# EAGLE design Qwiic Pi SHIM (EAGLE 9.5.1)
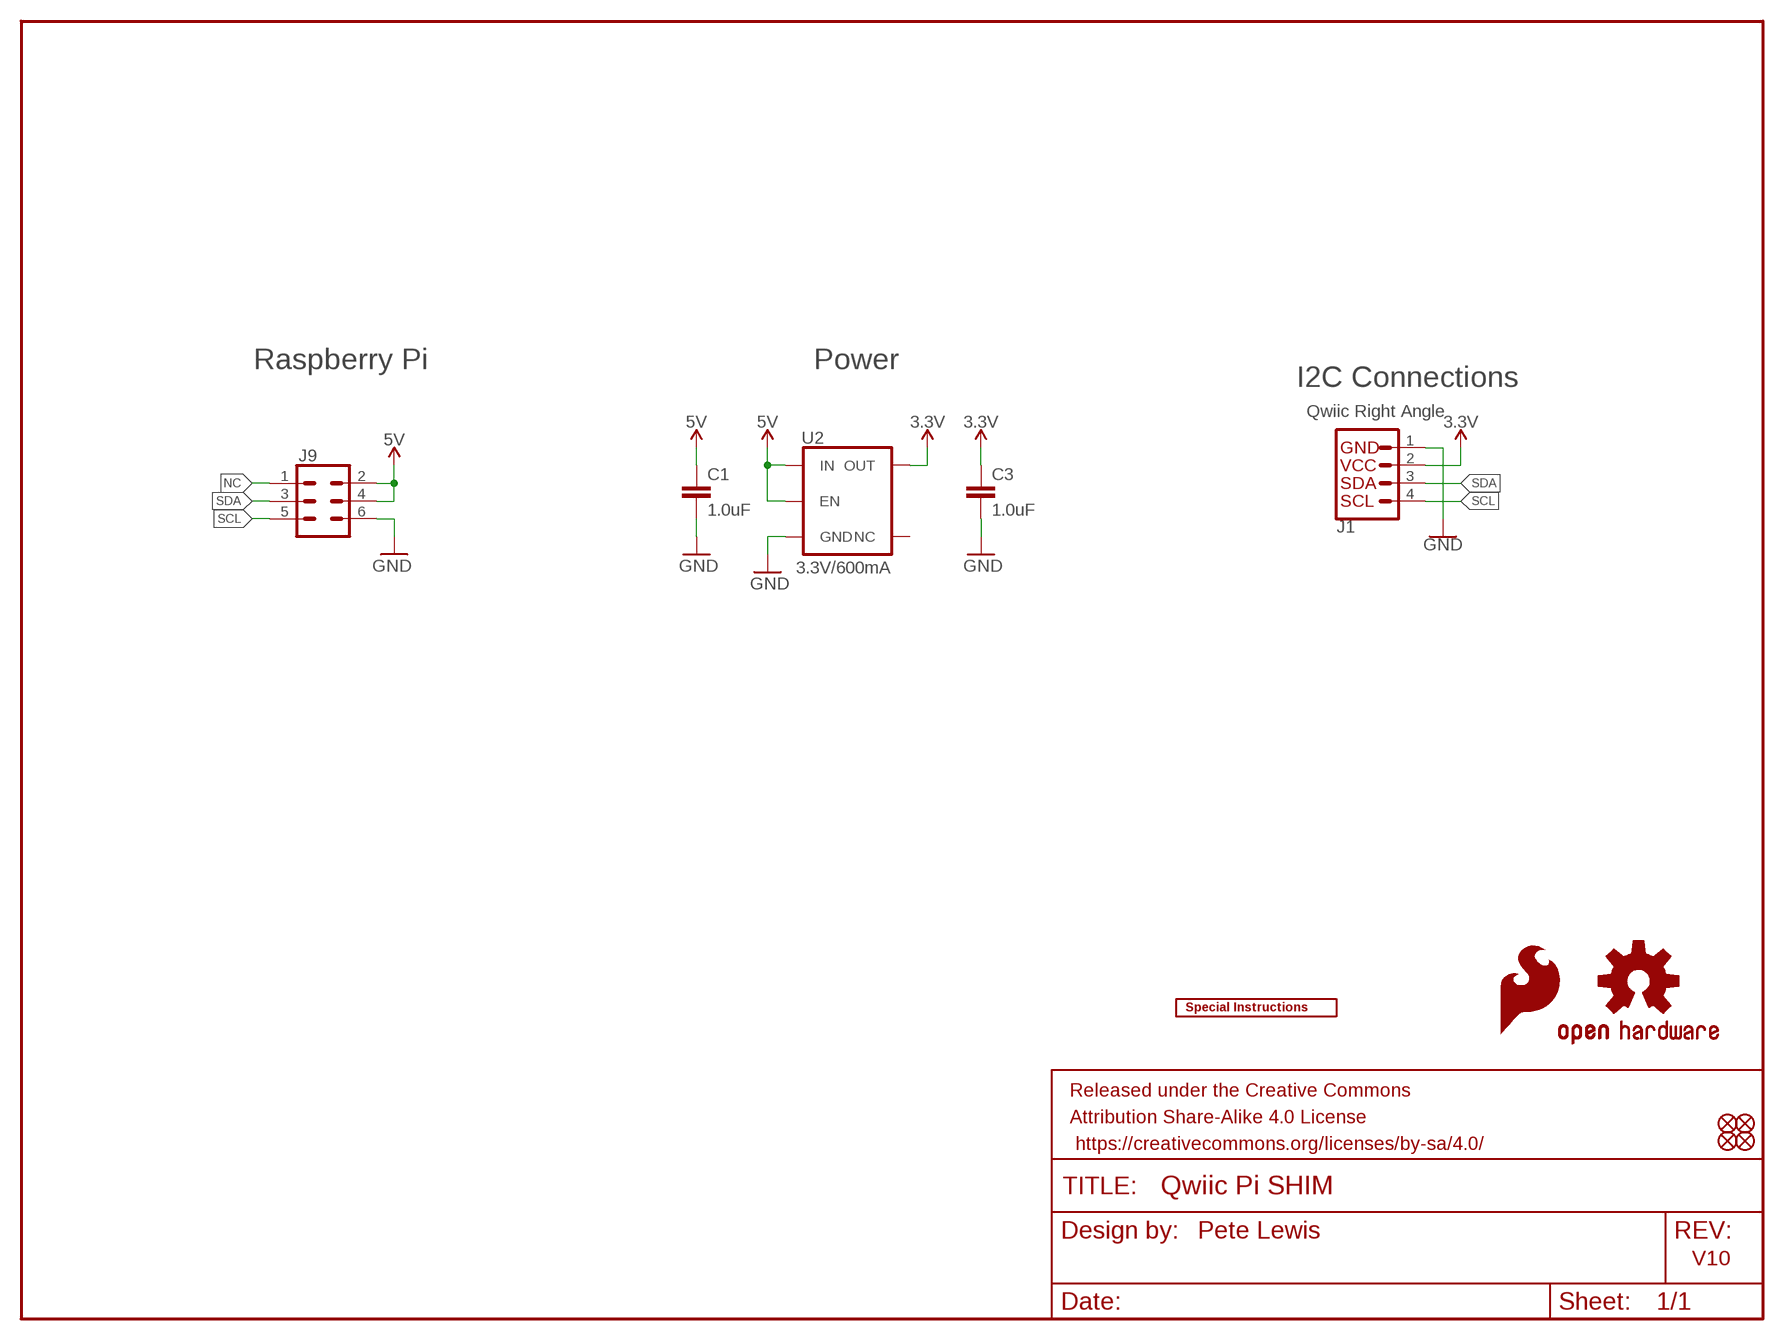
[diagram p0: schematic, sheet 1]

## Parts
C1  1.0uF  1.0UF-0603-16V-10%  [0603]
C3  1.0uF  1.0UF-0603-16V-10%  [0603]
FD1  FIDUCIALUFIDUCIAL  [FIDUCIAL-MICRO]
FD2  FIDUCIALUFIDUCIAL  [FIDUCIAL-MICRO]
FD3  FIDUCIALUFIDUCIAL  [FIDUCIAL-MICRO]
FD4  FIDUCIALUFIDUCIAL  [FIDUCIAL-MICRO]
FRAME1  FRAME-LETTER  [CREATIVE_COMMONS]
J1  Qwiic Right Angle  I2C_STANDARDQWIIC  [1X04_1MM_RA]
J9  SPARKFUN-CONNECTORS_CONN_03X2SINGLE_SLOT-4MILS  [SPARKFUN-CONNECTORS_2X3-NS_PISHIM_LOCKING_SLOTS-4MILS]
LOGO1  OSHW-LOGOMINI  [OSHW-LOGO-MINI]
U2  3.3V/600mA  V_REG_AP2112K-3.3V  [SOT23-5]
U$1  SFE_LOGO_FLAME.1_INCH  [SFE_LOGO_FLAME_.1]
U$4  SPECIAL_INSTRUCTIONS-ORDERING  [ORDERING_INSTRUCTIONS]

## Nets
3.3V: C3.1 J1.2 U2.5(OUT)
5V: C1.1 J9.2 J9.4 U2.1(IN) U2.3(EN)
GND [vcc]: C1.2 C3.2 J1.1 J9.6 U2.2(GND)
NC: J9.1
SCL: J1.4 J9.5
SDA: J1.3 J9.3
Unconnected: U2.4(NC)

## Notes on the sheet
- Raspberry Pi | Power
- I2C Connections
- Pete Lewis
- V10

## Library data of the parts
C1 C3 = SparkFun-Capacitors:1.0UF: 1µF ceramic capacitors A capacitor is a passive two-terminal electrical component used to store electrical energy temporarily in an electric field.; PROD_ID: CAP-00868
FD1-FD4 = SparkFun-Aesthetics:FIDUCIAL: Fiducial Alignment Points Point-of-reference for pick-and-place machines and other optical instruments.
FRAME1 = SparkFun-Aesthetics:FRAME-LETTER: Schematic Frame Standard 8.5x11 US Letter frame
J1 = SparkFun-Connectors:I2C_STANDARD: SparkFun I2C Standard Pinout Header SparkFun has standardized on a pinout for all I2C based sensor breakouts. This pinout allows I2C boards to be plugged directly into the headers on Arduino Uno compatible boards, and to be daisy chained easily. Example SparkFun Products: SparkFun Atmospheric Sensor Breakout - BME280 <https://www.sparkfun.com/products/13676> SparkFun Altitude/Pressure Sensor Breakout - MPL3115A2 <https://www.sparkfun.com/products/11084> SparkFun TOF Range Finder Sensor - VL6180 <https://www.sparkfun.com/products/12785>; PROD_ID: CONN-13694
J9 = Qwiic Pi SHIM:SPARKFUN-CONNECTORS_CONN_03X2: Multi connection point. Often used as Generic Header-pin footprint for 0.1 inch spaced/style header connections You can populate with any combo of single row headers, but if you'd like an exact match, check these: Header - 2x3 (Male, 0.1") <https://www.sparkfun.com/products/12807> (PRT-12807) Header - 2x3 (Female, 0.1") <https://www.sparkfun.com/products/13010> (PRT-13010) 2x3 Pin Shrouded Header <https://www.sparkfun.com/products/10877> (PRT-10877) On any of the 0.1 inch spaced packages, you can populate with these: Break Away Headers - Straight <https://www.sparkfun.com/products/116> (PRT-00116) Break Away Male Headers - Right Angle <https://www.sparkfun.com/products/553> (PRT-00553) Female Headers <https://www.sparkfun.com/products/115> (PRT-00115) Break Away Headers - Machine Pin <https://www.sparkfun.com/products/117> (PRT-00117) Break Away Female Headers - Swiss Machine Pin <https://www.sparkfun.com/products/743> (PRT-00743) Special note: the shrouded connector mates well with our 3x2 ribbon cables: Ribbon Crimp Connector - 6-pin (2x3, Female) <https://www.sparkfun.com/products/10651> (PRT-10651) Ribbon Cable - 6 wire (15ft) <https://www.sparkfun.com/products/10646> (PRT-10646)
LOGO1 = SparkFun-Aesthetics:OSHW-LOGO: Open Source Hardware Logo This logo indicates the piece of hardware it is found on incorporates a OSHW license and/or adheres to the definition of open source hardware found here: http://freedomdefined.org/OSHW
U2 = SparkFun-IC-Power:V_REG_AP2112: AP2112 - 600mA CMOS LDO Regulator w/ Enable The AP2112 is CMOS process low dropout linear regulator with enable function, the regulator delivers a guaranteed 600mA (min.) continuous load current. Features Output Voltage Accuracy: ±1.5% Output Current: 600mA (Min.) Foldback Short Current Protection: 50mA Enable Function to Turn ON/OFF VOUT Low Dropout Voltage (3.3V): 250mV (Typ.) @IOUT=600mA Excellent Load Regulation: 0.2%/A (Typ.) Excellent Line Regulation: 0.02%/V (Typ.) Low Quiescent Current: 55μA (Typ.) Low Standby Current: 0.01μA (Typ.) Low Output Noise: 50μVRMS PSRR: 100Hz -65dB, 1kHz -65dB OTSD Protection Stable with 1.0μF Flexible Cap: Ceramic, Tantalum and Aluminum Electrolytic Operation Temperature Range: -40°C to 85°C ESD: MM 400V, HBM 4000V; PROD_ID: VREG-12457; VALUE: 3.3V
U$1 = SparkFun-Aesthetics:SFE_LOGO_FLAME: SparkFun Flame Logo This is the SparkFun flame logo. The logo on the schematic will always be the same size; the package variant is the height of the flame. Default layer for the logo on the board is tSilk.
U$4 = SparkFun-Aesthetics:SPECIAL_INSTRUCTIONS: Special Ordering/Production Instructions Alert Symbol for special PCB ordering instructions or unique production process warnings. Ordering Instructions Production Instructions Types of information that should be added to box: Copper weight Soldermask color Silk color PCB thickness Number of layers PCB Standard: 1.6mm FR4 1 oz copper immersion silver plating red soldermask white silkscreen Types of information that should be added to box: Special wash requirements Depaneling instructions Humidification Glue curing Default text settings: 0.07 inch 9% ratio 50% line distance

## Net classes
0 Default: width 0.178 mm
1 vcc: width 0.178 mm

## Board
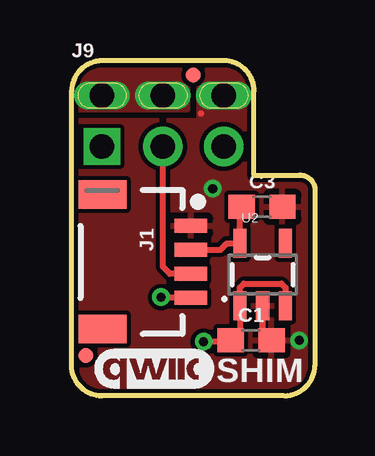
[diagram p1: board, top side]
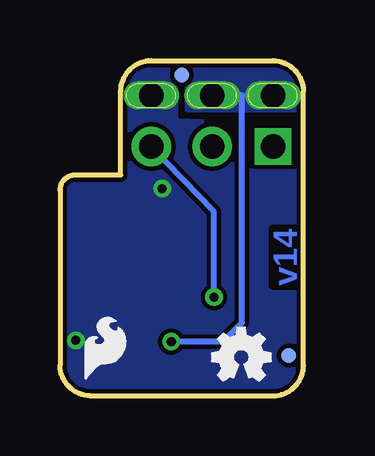
[diagram p2: board, bottom side, seen from below]

Size 10.16 x 13.97 mm. Coordinates in mm from the lower left corner, seen from the top.
Outline: 8.89,0 1.27,0 arc-90 0,1.27 0,12.7 arc-87 1.27,13.97 6.35,13.97 arc-90 7.62,12.7 7.62,9.2 9.53,9.2 arc-90 10.16,8.59 10.16,1.27 arc-87 8.89,0
Copper layers (1*16): Top 0.035mm / dielectric 1.5mm / Bottom 0.035mm
Design rules "SparkFun-2-layer-TIGHT *": minimum track width 7mil, minimum drill 15mil, track to track 7mil, track to pad 7mil, pad to pad 7mil, via to via 7mil, smd to smd 7mil, copper to edge 7mil, drill to drill 7mil, minimum pad ring 2mil, minimum via ring 7mil, stop-mask expansion 4mil, vias tented up to drill 25mil, thermal gap 10mil

### Footprints (pad centres in the part's own frame; a part is rotated, then mirrored left to right if it is on the bottom)
0603 = smd 1.1 x 1: 1 -0.85,0; 2 0.85,0
FIDUCIAL-MICRO = smd 0.635 x 0.635: 1 0,0
1X04_1MM_RA = smd 0.6 x 1.35: 1 -1.5,0; 2 -0.5,0; 3 0.5,0; 4 1.5,0 | smd 1.2 x 2: NC1 2.8,-3.675; NC2 -2.8,-3.675
SPARKFUN-CONNECTORS_2X3-NS_PISHIM_LOCKING_SLOTS-4MILS = drill 1.016 pad 1.524 square: 1 -2.54,-1.041 | drill 1.016 pad 1.168 long: 2 -2.54,1.092; 4 0,1.092; 6 2.54,1.092 | drill 1.016 pad 1.651: 3 0,-1.041; 5 2.54,-1.041
SOT23-5 = smd 0.55 x 1.2: 1 -0.95,-1.3; 2 0,-1.3; 3 0.95,-1.3; 4 0.95,1.3; 5 -0.95,1.3

### Placement (x,y rotation side)
C1  7.49,2.31 0 top
C3  7.95,7.87 0 top
FD1  5.08,13.36 180 top
FD2  0.61,1.68 180 top
FD3  0.61,1.68 0 bottom
FD4  5.08,13.36 0 bottom
FRAME1  -11.43,-13.97 0 top  (outside the outline)
J1  4.98,5.59 270 top
J9  3.81,11.43 0 top
LOGO1  2.59,1.63 0 bottom
U2  7.98,5.05 0 top
U$1  9.42,0.36 0 bottom
U$3  [QWIIC_5MM]  3.43,1.14 0 top
U$4  -31.75,-15.24 0 top  (outside the outline)

### Tracks (layer width: path | path; a pad name or v marks a point on that pad's centre or on a via)
3.3V
  Top 0.254: J1.2 6.21,6.09 6.48,6.36 U2.5 7.03,7.8 C3.1
5V  (via drill 0.38)
  Top 0.254: U2.3 8.93,4.51 8.76,4.67 7.19,4.67 7.03,4.51 U2.1 7.03,2.69 C1.1 6.59,2.26 v5.51,2.26
  Bottom 0.254: v5.51,2.26 3.35,2.26 2.56,3.05 2.56,12.52 J9.4
  pour Top: 4.85,13.97 0,13.97 0,11.91 4.85,11.91
  pour Bottom: 4.85,11.91 0,11.91 0,13.97 4.85,13.97
GND  (via drill 0.38)
  Top 0.254: 5.41,11.76 5.38,11.76 | U2.2 7.98,2.68 C1.2
  other vias: 9.5,2.31 5.89,8.64
  pour Top: 0,11.46 5.33,11.46 5.33,13.97 10.16,13.97 10.16,0 0,0
  pour Bottom: 0.03,11.4 4.8,11.43 5.33,11.43 5.33,13.97 10.16,13.97 10.16,0 0.03,0
SCL  (via drill 0.38)
  Top 0.254: J1.4 3.76,4.09 v3.73,4.12
  Bottom 0.254: J9.5 3.73,7.67 v3.73,4.12
SDA
  Top 0.254: J9.3 3.81,7.62 3.81,5.38 4.11,5.09 J1.3

### Text on the board
Bottom: v14
tPlace: SHIM
tDocu: Pete Lewis | 0.8MM Thickness